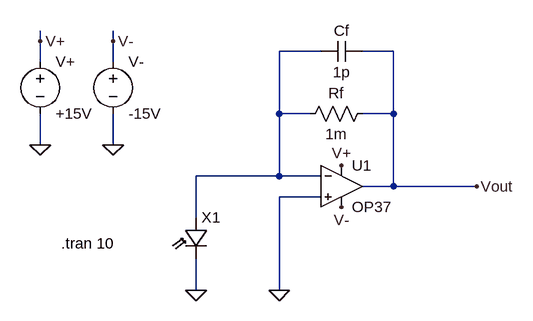
[diagram p0: schematic opamp.asc]
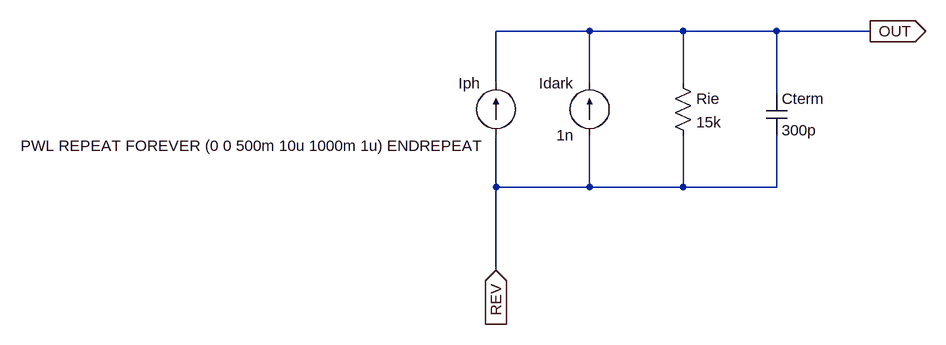
[diagram p1: sub-circuit psd.asc]
opamp.asc, the LTspice schematic file:
Version 4
SHEET 1 880 680
WIRE -96 64 -96 48
WIRE 16 64 16 48
WIRE 336 80 272 80
WIRE 448 80 400 80
WIRE -96 96 -96 64
WIRE 16 96 16 64
WIRE 272 176 272 80
WIRE 320 176 272 176
WIRE 448 176 448 80
WIRE 448 176 400 176
WIRE -96 224 -96 176
WIRE 16 224 16 176
WIRE 272 272 272 176
WIRE 272 272 144 272
WIRE 336 272 272 272
WIRE 448 288 448 176
WIRE 448 288 400 288
WIRE 576 288 448 288
WIRE 336 304 272 304
WIRE 144 336 144 272
WIRE 144 448 144 400
WIRE 272 448 272 304
FLAG 144 448 0
FLAG 272 448 0
FLAG -96 224 0
FLAG 16 224 0
FLAG -96 64 V+
FLAG 16 64 V-
FLAG 368 256 V+
FLAG 368 320 V-
FLAG 576 288 Vout
SYMBOL Opamps/OP37 368 224 R0
SYMATTR InstName U1
SYMBOL voltage -96 80 R0
SYMATTR InstName V+
SYMATTR Value +15V
SYMBOL voltage 16 80 R0
SYMATTR InstName V-
SYMATTR Value -15V
SYMBOL res 416 160 R90
WINDOW 0 0 56 VBottom 2
WINDOW 3 32 56 VTop 2
SYMATTR InstName Rf
SYMATTR Value 1m
SYMBOL cap 400 64 R90
WINDOW 0 0 32 VBottom 2
WINDOW 3 32 32 VTop 2
SYMATTR InstName Cf
SYMATTR Value 1p
SYMBOL psd 128 336 R0
SYMATTR InstName X1
TEXT -64 376 Left 2 !.tran 10

psd.asc, the sub-circuit schematic file:
Version 4
SHEET 1 880 680
WIRE 176 112 32 112
WIRE 320 112 176 112
WIRE 464 112 320 112
WIRE 608 112 464 112
WIRE 32 192 32 112
WIRE 176 192 176 112
WIRE 320 192 320 112
WIRE 464 208 464 112
WIRE 32 352 32 272
WIRE 176 352 176 272
WIRE 176 352 32 352
WIRE 320 352 320 272
WIRE 320 352 176 352
WIRE 464 352 464 272
WIRE 464 352 320 352
WIRE 32 480 32 352
FLAG 608 112 OUT
IOPIN 608 112 Out
FLAG 32 480 REV
IOPIN 32 480 In
SYMBOL current 32 272 R180
WINDOW 0 24 80 Left 2
WINDOW 3 17 -16 Left 2
SYMATTR InstName Iph
SYMATTR Value PWL REPEAT FOREVER (0 0 500m 10u 1000m 1u) ENDREPEAT
SYMBOL current 176 272 R180
WINDOW 0 24 80 Left 2
WINDOW 3 24 0 Left 2
SYMATTR InstName Idark
SYMATTR Value 1n
SYMBOL res 304 176 R0
SYMATTR InstName Rie
SYMATTR Value 15k
SYMBOL cap 448 208 R0
SYMATTR InstName Cterm
SYMATTR Value 300p

The netlist it stands for:
* opamp.asc
XU1 0 N001 V+ V- Vout LT1037  ; OP37, pins In+ In- V+ V- OUT
V+ V+ 0 +15V
V- V- 0 -15V
Rf Vout N001 1m
Cf Vout N001 1p
XX1 N001 0 psd

* block symbol definitions
.subckt psd OUT REV
Iph REV OUT PWL REPEAT FOREVER (0 0 500m 10u 1000m 1u) ENDREPEAT
Idark REV OUT 1n
Rie OUT REV 15k
Cterm OUT REV 300p
.ends psd

.tran 10
.lib LTC.lib
.backanno
.end